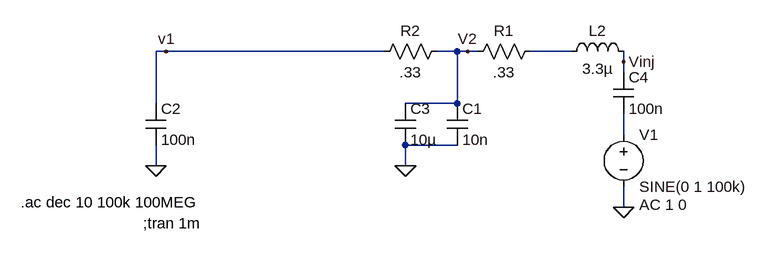
[diagram p0: schematic Draft1.asc]
Draft1.asc, the LTspice schematic file:
Version 4
SHEET 1 880 680
WIRE -256 -112 -272 -112
WIRE 80 -112 -256 -112
WIRE 192 -112 160 -112
WIRE 208 -112 192 -112
WIRE 224 -112 208 -112
WIRE 368 -112 304 -112
WIRE 448 -96 448 -112
WIRE 448 -80 448 -96
WIRE -272 -32 -272 -112
WIRE 192 -32 192 -112
WIRE 192 -32 112 -32
WIRE 448 16 448 -16
WIRE 192 32 112 32
WIRE -272 64 -272 32
WIRE 112 64 112 32
WIRE 448 128 448 96
FLAG 112 64 0
FLAG -272 64 0
FLAG 448 128 0
FLAG -256 -112 v1
FLAG 208 -112 V2
FLAG 448 -96 Vinj
SYMBOL ind 352 -96 R270
WINDOW 0 32 56 VTop 2
WINDOW 3 5 56 VBottom 2
SYMATTR InstName L2
SYMATTR Value 3.3µ
SYMBOL res 320 -128 R90
WINDOW 0 0 56 VBottom 2
WINDOW 3 32 56 VTop 2
SYMATTR InstName R1
SYMATTR Value .33
SYMBOL res 176 -128 R90
WINDOW 0 0 56 VBottom 2
WINDOW 3 32 56 VTop 2
SYMATTR InstName R2
SYMATTR Value .33
SYMBOL cap 176 -32 R0
SYMATTR InstName C1
SYMATTR Value 10n
SYMBOL cap -288 -32 R0
SYMATTR InstName C2
SYMATTR Value 100n
SYMBOL cap 96 -32 R0
SYMATTR InstName C3
SYMATTR Value 10µ
SYMBOL cap 432 -80 R0
SYMATTR InstName C4
SYMATTR Value 100n
SYMBOL voltage 448 0 R0
WINDOW 123 24 124 Left 2
WINDOW 39 0 0 Left 2
SYMATTR InstName V1
SYMATTR Value SINE(0 1 100k)
SYMATTR Value2 AC 1 0
TEXT -292 152 Left 2 !;tran 1m
TEXT -480 120 Left 2 !.ac dec 10 100k 100MEG

The netlist it stands for:
* Draft1.asc
L2 N001 Vinj 3.3µ
R1 N001 V2 .33
R2 V2 v1 .33
C1 V2 0 10n
C2 v1 0 100n
C3 V2 0 10µ
C4 Vinj N002 100n
V1 N002 0 SINE(0 1 100k) AC 1 0
;tran 1m
.ac dec 10 100k 100MEG
.backanno
.end